# Altium schematic sheet PMIC.SchDoc
size A
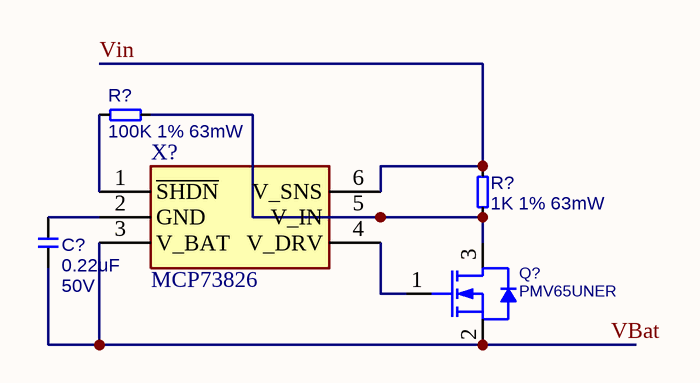
[diagram p0: PMIC.SchDoc]

## Parts
(Parts that share a designator on the sheet are numbered #1, #2 ... from top to bottom, then left to right.)
C?  value 0.22uF  Rating: 50V  [T_CAPC0603X33N]  (hidden comment: 0.22uF 50V 10% X7R)
Q?  PMV65UNER  [SOT95P230X110-3N]
R?#1  100K 1% 63mW  [RESC1005X40N]
R?#2  1K 1% 63mW  [RESC1005X40N]
X?  MCP73826

## Nets
VBat: C?.1 Q?.2(D) X?.3(V_BAT)
Vin: R?#2.2 X?.6(V_SNS)
NetC?_2: C?.2 X?.2(GND)
NetQ?_1: Q?.1(G) X?.4(V_DRV)
NetQ?_3: Q?.3(S) R?#1.1 R?#2.1 X?.5(V_IN)
NetR?#1_2: R?#1.2 X?.1(~{SHDN})

## Library data of the parts
C? = C-22uF-50V-10%-0805_1: Capacitor Ceramic X7R 0.22uF 50V 10% 0805; Tolerance: 10%; Type: X7R; Supplier 1: Digi-Key; Supplier Part Number 1: 1276-1093-1-ND
Q? = NMOS: N-Channel MOSFET; FP_DESC: TO-236AB; MFG: Nexperia USA Inc.; MFG_PN: PMV65UNER; Footprint Checked: Ok; Simbol Checked: -
R?#1 = R-100K-1%-0402: Resistor 100Kohm 63mW 1% 0402; Manufacturer: <GENERIC>; Replacement Allowed: Yes; Power: 63mW; Tolerance: 1%; Value: 100k; Footprint: R0402; Manufacturer Part Number: <GENERIC>; Supplier 1: Digi-Key; Supplier 2: Digi-Key; Supplier Part Number 2: 541-100KLCT-ND; Supplier Part Number 1: 311-100KLRDKR-ND
R?#2 = R-100m-1%-0402_1: Resistor 1mohm 63mW 1% 0402; Manufacturer: <GENERIC>; Replacement Allowed: Yes; Power: 63mW; Tolerance: 1%; Footprint: R0402; Manufacturer Part Number: <GENERIC>; Value: 1K; Supplier 1: Digi-Key; Supplier Part Number 1: YAG2306CT-ND
X? = IC-Microchip-MCP73826: Microchip-MCP73826 - PMIC; Supplier 1: Digi-Key; Supplier 2: Digi-Key; Supplier Part Number 1: MCP73826-4.2VCHCT-ND; Supplier Part Number 2: MCP73826-4.2VCHDKR-ND